# EAGLE design blinky_board (EAGLE 9.5.2)
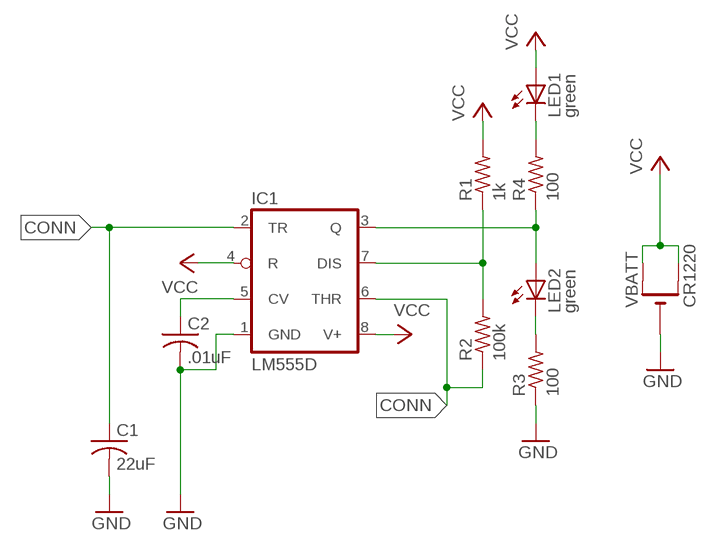
[diagram p0: schematic, sheet 1]

## Parts
C1  22uF  C-USC0805  [C0805]
C2  .01uF  C-USC0805  [C0805]
IC1  LM555D  [SO08]
LED1  green  LEDCHIPLED_0805  [CHIPLED_0805]
LED2  green  LEDCHIPLED_0805  [CHIPLED_0805]
R1  1k  R-US_R0805  [R0805]
R2  100k  R-US_R0805  [R0805]
R3  100  R-US_R0805  [R0805]
R4  100  R-US_R0805  [R0805]
VBATT  CR1220  CR1220SMT  [CR1220-SMD]

## Nets
CONN: C1.1 IC1.2(TR) IC1.6(THR) R2.1
GND: C1.2 C2.2 IC1.1(GND) R3.1 VBATT.-
N$1: LED1.C R4.2
N$2: IC1.3(Q) LED2.A R4.1
N$3: LED2.C R3.2
N$4: IC1.7(DIS) R1.1 R2.2
N$5: C2.1 IC1.5(CV)
VCC: IC1.4(R) IC1.8(V+) LED1.A R1.2 VBATT.+$1(+) VBATT.+$2(+1)

## Library data of the parts
C1 C2 = adafruit:C-US: CAPACITOR, American symbol
IC1 = adafruit:*555: TIMER Changed DIP package to have round (not oval) pin pads http://www.ladyada.net/library/pcb/eaglelibrary.html
LED1 LED2 = adafruit:LED: LED OSRAM: - CHIPLED LG R971, LG N971, LY N971, LG Q971, LY Q971, LO R971, LY R971 LH N974, LH R974 LS Q976, LO Q976, LY Q976 LO Q996 - Hyper CHIPLED LW Q18S LB Q993, LB Q99A, LB R99A - SideLED LS A670, LO A670, LY A670, LG A670, LP A670 LB A673, LV A673, LT A673, LW A673 LH A674 LY A675 LS A676, LA A676, LO A676, LY A676, LW A676 LS A679, LY A679, LG A679 - Hyper Micro SIDELED® LS Y876, LA Y876, LO Y876, LY Y876 LT Y87S - SmartLED LW L88C, LW L88S LB L89C, LB L89S, LG L890 LS L89K, LO L89K, LY L89K LS L896, LA L896, LO L896, LY L896 - TOPLED LS T670, LO T670, LY T670, LG T670, LP T670 LSG T670, LSP T670, LSY T670, LOP T670, LYG T670 LG T671, LOG T671, LSG T671 LB T673, LV T673, LT T673, LW T673 LH T674 LS T676, LA T676, LO T676, LY T676, LB T676, LH T676, LSB T676, LW T676 LB T67C, LV T67C, LT T67C, LS T67K, LO T67K, LY T67K, LW E67C LS E67B, LA E67B, LO E67B, LY E67B, LB E67C, LV E67C, LT E67C LW T67C LS T679, LY T679, LG T679 LS T770, LO T770, LY T770, LG T770, LP T770 LB T773, LV T773, LT T773, LW T773 LH T774 LS E675, LA E675, LY E675, LS T675 LS T776, LA T776, LO T776, LY T776, LB T776 LHGB T686 LT T68C, LB T68C - Hyper Mini TOPLED® LB M676 - Mini TOPLED Santana® LG M470 LS M47K, LO M47K, LY M47K Source: http://www.osram.convergy.de/
R1-R4 = adafruit:R-US_: RESISTOR, American symbol
VBATT = adafruit:CR1220: CR1216/CR1220/CR1225 12mm 3V lithium coin cell Great for battery packup. Both SMT and THM holders. Note the THM package has the ground pads on both sides of the PCB so that the masks are the same - this reduces the cost

## Board
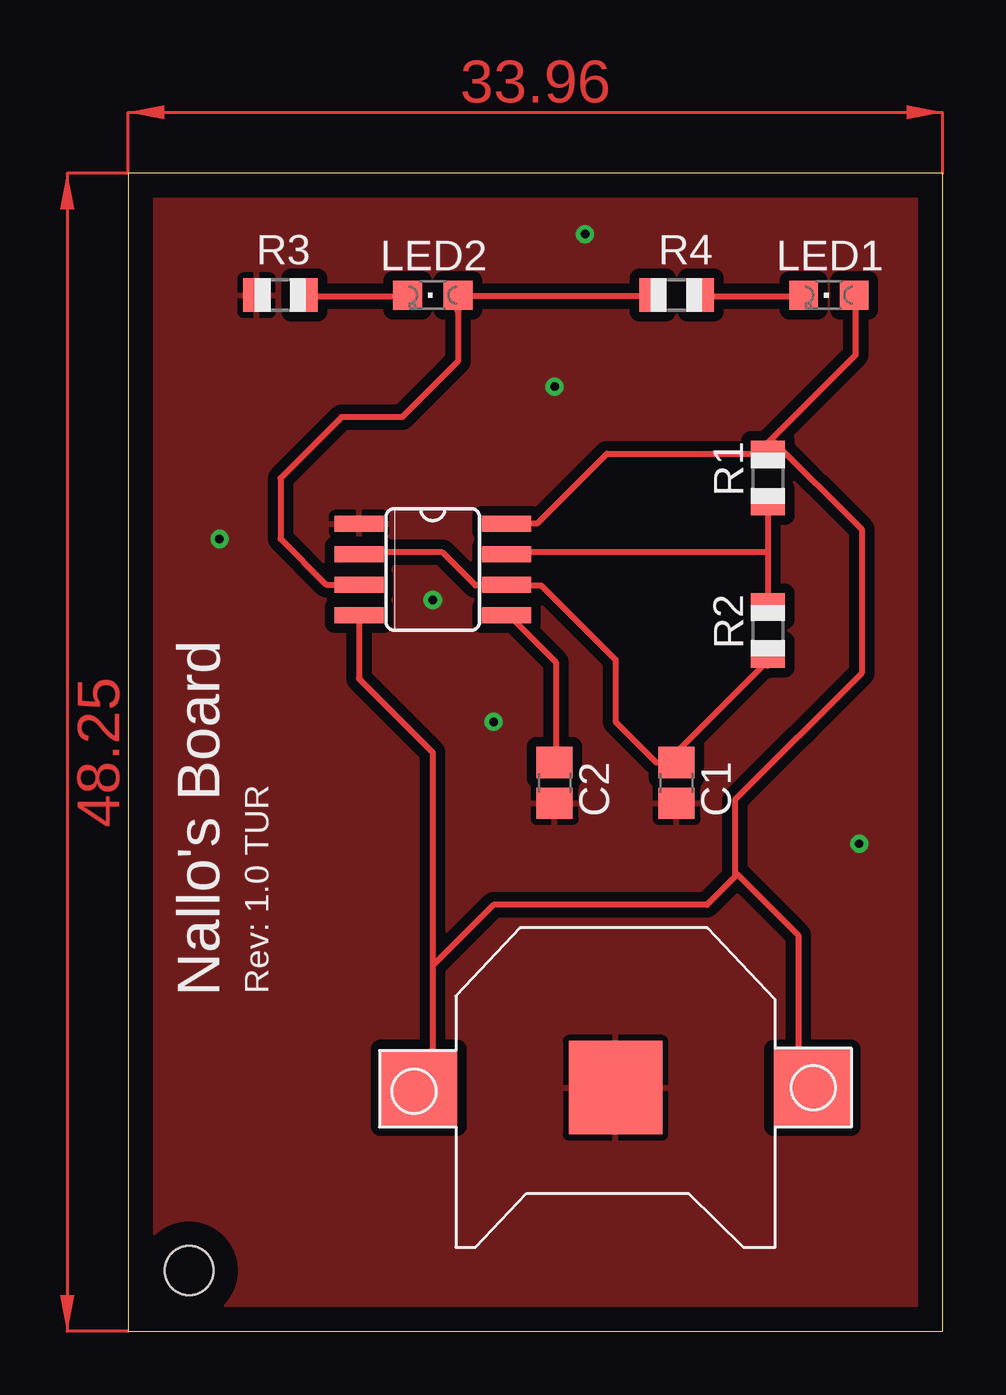
[diagram p1: board, top side]
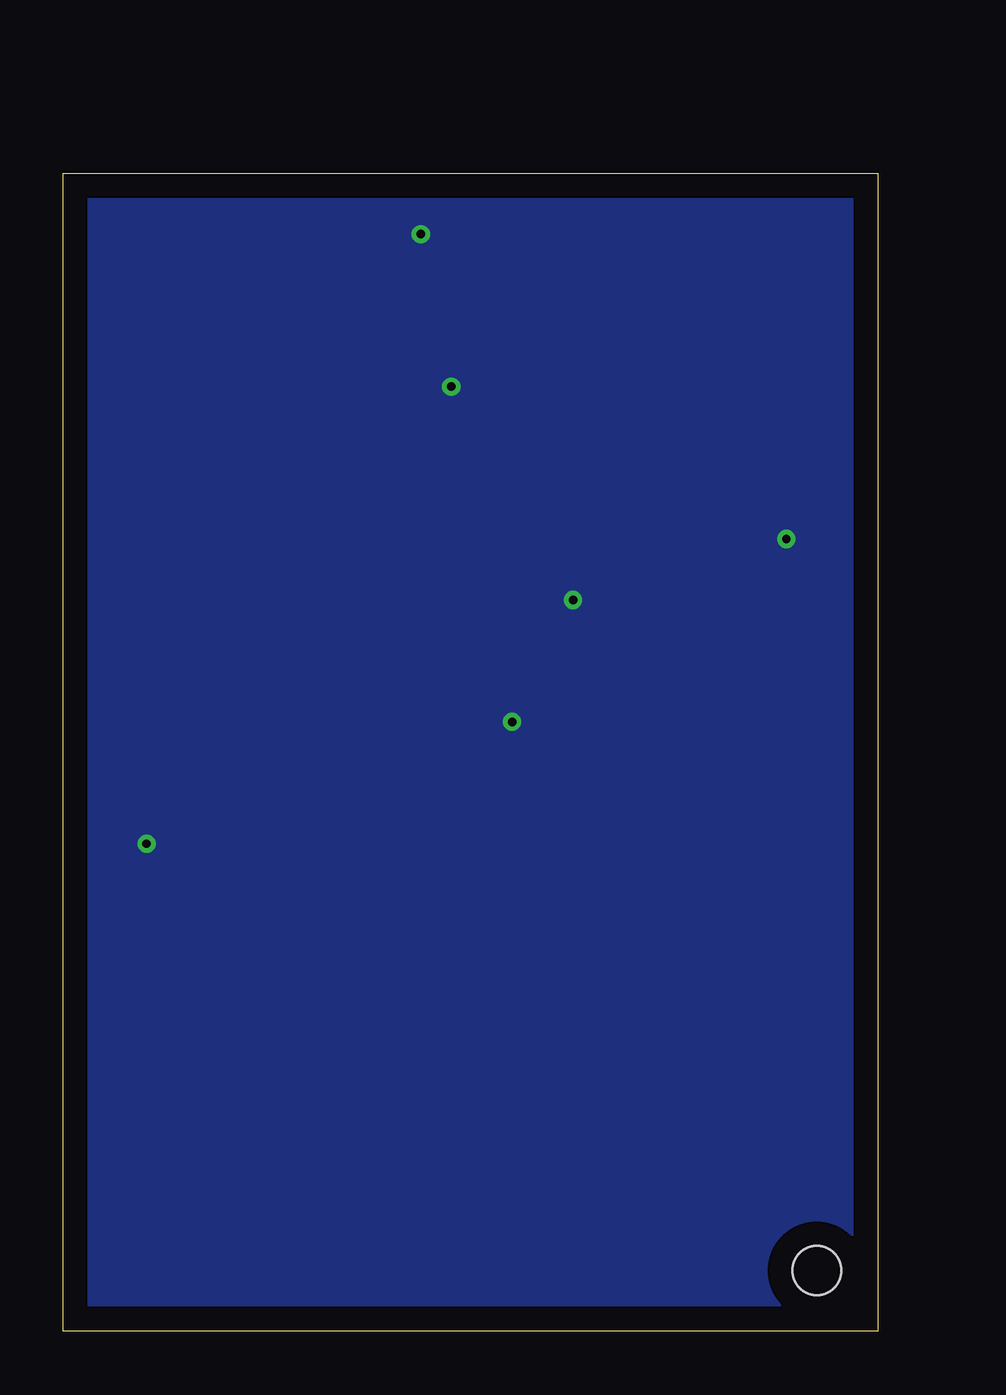
[diagram p2: board, bottom side, seen from below]

Size 33.96 x 48.25 mm. Coordinates in mm from the lower left corner, seen from the top.
Outline: 0,0 33.96,0 33.96,48.25 0,48.25 0,0
Copper layers (1*16): Top 0.035mm / dielectric 1.5mm / Bottom 0.035mm
Design rules "default": minimum track width 6mil, minimum drill 0.35mm, track to track 6mil, track to pad 6mil, pad to pad 6mil, via to via 6mil, smd to smd 6mil, copper to edge 40mil, drill to drill 6mil, minimum pad ring 10mil, minimum via ring 8mil, stop-mask expansion 4mil, vias tented up to drill 0mil, thermal gap 10mil
Holes 2.03 mm at 2.54,2.54

### Footprints (pad centres in the part's own frame; a part is rotated, then mirrored left to right if it is on the bottom)
C0805 = smd 1.3 x 1.5: 1 -0.85,0; 2 0.85,0
SO08 = smd 0.66 x 2.032: 1 -1.905,-3.073; 2 -0.635,-3.073; 3 0.635,-3.073; 4 1.905,-3.073; 5 1.905,3.073; 6 0.635,3.073; 7 -0.635,3.073; 8 -1.905,3.073
CHIPLED_0805 = smd 1.2 x 1.2: A 0,-1.05; C 0,1.05
R0805 = smd 1.1 x 1.4: 1 -1,0; 2 1,0
CR1220-SMD = smd 3.2 x 3.2: +$1 -8.2,0; +$2 8.2,0 | smd 3.9 x 3.9: - 0,0

### Placement (x,y rotation side)
C1  22.86,22.86 270 top
C2  17.78,22.86 270 top
IC1  12.7,31.75 270 top
LED1  29.21,43.18 90 top
LED2  12.7,43.18 90 top
R1  26.67,35.56 90 top
R2  26.67,29.21 90 top
R3  6.35,43.18 0 top
R4  22.86,43.18 0 top
VBATT  20.32,10.16 180 top

### Tracks (layer width: path | path; a pad name or v marks a point on that pad's centre or on a via)
CONN
  Top 0.254: 26.67,27.74 26.67,27.94 | 26.67,27.94 R2.1 | IC1.2 9.75,32.46 13.11,32.46 14.48,31.09 15.7,31.09 IC1.6 15.85,31.09 17.22,31.09 20.32,27.99 20.32,25.4 22.01,23.71 C1.1 22.86,24.13 26.67,27.94
GND  (via drill 0.35 pad 0.55)
  other vias: 3.81,33.02 17.78,39.37 15.24,25.4 30.48,20.32 12.7,30.48 19.05,45.72
  pour Top (isolate 0.406): -2.54,50.8 -2.54,-2.54 36.83,-2.54 36.83,50.8
  pour Bottom (isolate 0.406): -1.27,49.53 35.56,49.53 35.56,-1.27 -1.27,-1.27
N$1
  Top 0.254: LED1.C 28.04,43.13 23.93,43.13 R4.2
N$2
  Top 0.254: LED2.A 13.87,43.13 21.79,43.13 R4.1 | 13.72,42.52 13.72,43.13 LED2.A | 9.75,31.09 IC1.3 8.26,31.11 6.35,33.02 6.35,35.56 8.89,38.1 11.43,38.1 13.75,40.42 LED2.A
N$3
  Top 0.254: LED2.C 11.58,43.13 7.47,43.13 R3.2
N$4
  Top 0.254: R1.1 26.67,32.46 | 26.67,32.46 R2.2 | 26.67,32.46 15.85,32.46 IC1.7
N$5
  Top 0.254: C2.1 17.83,23.77 17.83,27.89 15.85,29.87 IC1.5
VCC
  Top 0.254: 27.94,10.21 28.5,10.21 VBATT.+$1 | 27.94,10.21 27.89,10.21 | VBATT.+$2 12.19,10.21 12.7,10.72 | 26.82,37.19 26.67,37.03 26.67,36.58 | 26.82,37.19 30.33,40.69 30.33,43.13 LED1.A | 9.6,29.87 IC1.4 9.63,27.2 12.7,24.13 12.7,15.24 | 15.7,33.68 IC1.8 15.85,33.68 17.07,33.68 19.96,36.58 26.67,36.58 | 26.67,36.58 R1.2 | 26.82,37.19 30.58,33.43 30.58,27.43 25.3,22.15 25.3,19.05 25.4,19.05 | 25.4,19.05 27.94,16.51 27.94,10.21 | 25.4,19.05 24.13,17.78 15.24,17.78 12.7,15.24 | 12.7,15.24 12.7,11.43 12.7,10.72 | 12.7,10.72 12.7,10.16
(copper drawn outside any net)
  shapes: Top area x2

### Text on the board
tNames: Nallo's Board | Rev: 1.0 TUR